# EAGLE schematic USB2DAC PCB (EAGLE 6.1)

## Sheet 1 of 4
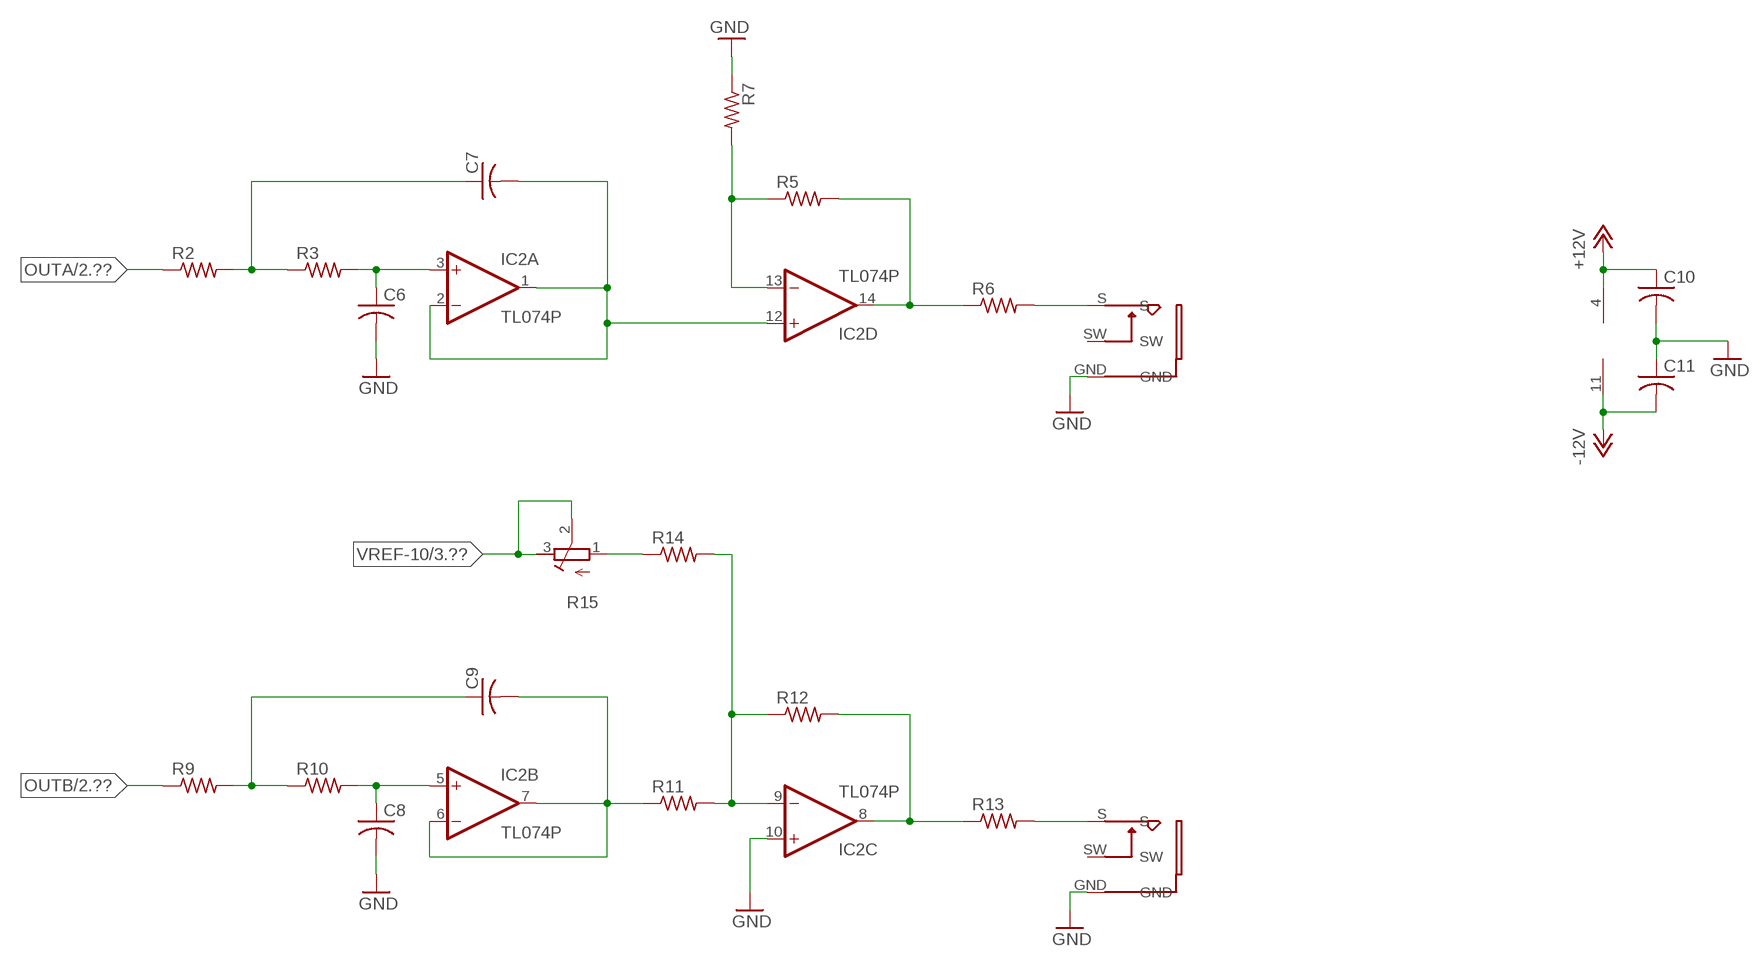
[diagram p0: schematic, sheet 1]

### Parts
C6  C-USC1206K  [C1206K]
C7  C-USC1206K  [C1206K]
C8  C-USC1206K  [C1206K]
C9  C-USC1206K  [C1206K]
C10  C-USC1206K  [C1206K]
C11  C-USC1206K  [C1206K]
IC2  TL074P  [DIL14]
OUT1  PJ302M  [PJ302M]
OUT2  PJ302M  [PJ302M]
R2  R-US_R1206  [R1206]
R3  R-US_R1206  [R1206]
R5  R-US_R1206  [R1206]
R6  R-US_R1206  [R1206]
R7  R-US_R1206  [R1206]
R9  R-US_R1206  [R1206]
R10  R-US_R1206  [R1206]
R11  R-US_R1206  [R1206]
R12  R-US_R1206  [R1206]
R13  R-US_R1206  [R1206]
R14  R-US_R1206  [R1206]
R15  R-TRIMM3296P  [RTRIM3296P]

### Nets
+12V: C10.1 IC2.4(P:V+) ; also sheet 2,3
-12V: C11.2 IC2.11(P:V-) ; also sheet 3
GND: C6.2 C8.2 C10.2 C11.1 IC2.10(C:+IN) OUT1.GND OUT2.GND R7.1 ; also sheet 2,3,4
N$10: C6.1 IC2.3(A:+IN) R3.2
N$11: C7.1 R2.2 R3.1
N$12: IC2.13(D:-IN) R5.1 R7.2
N$13: IC2.14(D:OUT) R5.2 R6.1
N$15: C9.2 IC2.6(B:-IN) IC2.7(B:OUT) R11.1
N$16: C8.1 IC2.5(B:+IN) R10.2
N$17: C9.1 R9.2 R10.1
N$18: IC2.9(C:-IN) R11.2 R12.1 R14.2
N$19: IC2.8(C:OUT) R12.2 R13.1
N$20: R14.1 R15.1(E)
N$31: C7.2 IC2.1(A:OUT) IC2.2(A:-IN) IC2.12(D:+IN)
OUT1: OUT1.S R6.2
OUT2: OUT2.S R13.2
OUTA: R2.1 ; also sheet 2
OUTB: R9.1 ; also sheet 2
VREF-10: R15.2(S) R15.3(A) ; also sheet 3
Unconnected: OUT1.SW OUT2.SW

## Sheet 2 of 4
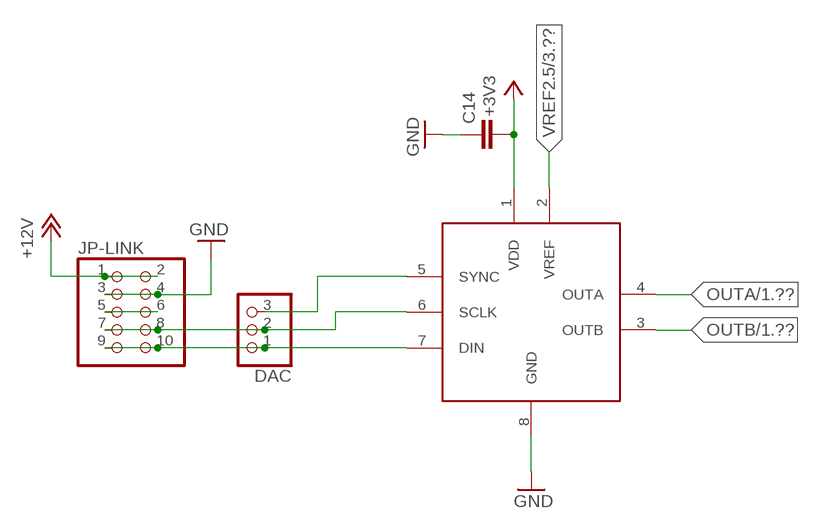
[diagram p1: schematic, sheet 2]

### Parts
C14  C-EUC1206K  [C1206K]
DAC  PINHD-1X3_2.54  [1X03]
JP-LINK  PINHD-2X5_2.54  [2X05]
U$1  DAC8552  [MSOP-8]

### Nets
+3V3: C14.2 U$1.1(VDD) ; also sheet 3
+12V: JP-LINK.1 JP-LINK.2 ; also sheet 1,3
GND: C14.1 JP-LINK.3 JP-LINK.4 U$1.8(GND) ; also sheet 1,3,4
N$1: DAC.3 U$1.5(SYNC)
N$2: DAC.2 JP-LINK.7 JP-LINK.8 U$1.6(SCLK)
N$3: DAC.1 JP-LINK.9 JP-LINK.10 U$1.7(DIN)
N$29: JP-LINK.5 JP-LINK.6
OUTA: U$1.4(OUTA) ; also sheet 1
OUTB: U$1.3(OUTB) ; also sheet 1
VREF2.5: U$1.2(VREF) ; also sheet 3

## Sheet 3 of 4
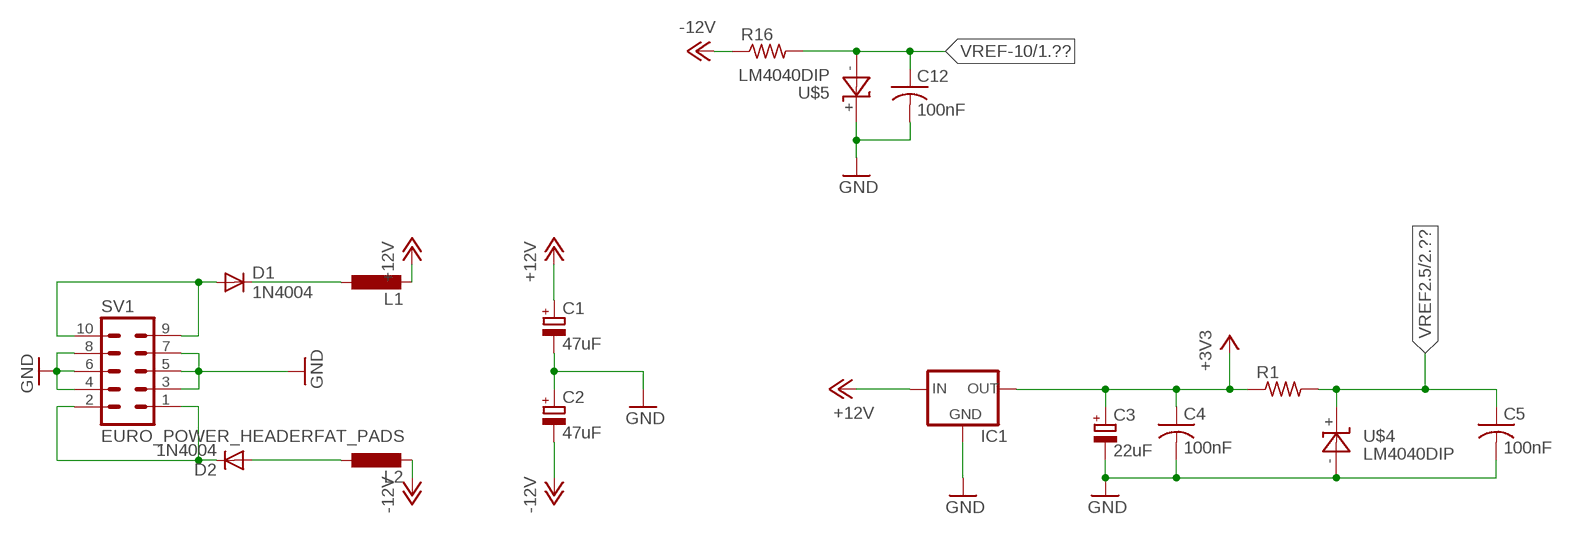
[diagram p2: schematic, sheet 3]

### Parts
C1  47uF  CPOL-EUE2-5  [E2-5]
C2  47uF  CPOL-EUE2-5  [E2-5]
C3  22uF  CPOL-EUE2-5  [E2-5]
C4  100nF  C-USC1206K  [C1206K]
C5  100nF  C-USC1206K  [C1206K]
C12  100nF  C-USC1206K  [C1206K]
D1  1N4004  [DO41-10]
D2  1N4004  [DO41-10]
IC1  78LXX  [78LXX]
L1  L-EU0207/10  [0207/10]
L2  L-EU0207/10  [0207/10]
R1  R-US_R1206  [R1206]
R16  R-US_R1206  [R1206]
SV1  EURO_POWER_HEADERFAT_PADS  [EURO_PWR_HEADER_FAT]
U$4  LM4040DIP  [TO-92]
U$5  LM4040DIP  [TO-92]

### Nets
+3V3: C3.+ C4.1 IC1.OUT R1.1 ; also sheet 2
+12V: C1.+ IC1.IN L1.2 ; also sheet 1,2
-12V: C2.- L2.2 R16.1 ; also sheet 1
GND: C1.- C2.+ C3.- C4.2 C5.2 C12.2 IC1.GND SV1.3 SV1.4 SV1.5 SV1.6 SV1.7 SV1.8 U$4.- U$5.+ ; also sheet 1,2,4
N$7: D2.C SV1.1 SV1.2
N$8: D1.A SV1.9 SV1.10
N$21: D2.A L2.1
N$22: D1.C L1.1
VREF2.5: C5.1 R1.2 U$4.+ ; also sheet 2
VREF-10: C12.1 R16.2 U$5.- ; also sheet 1

## Sheet 4 of 4
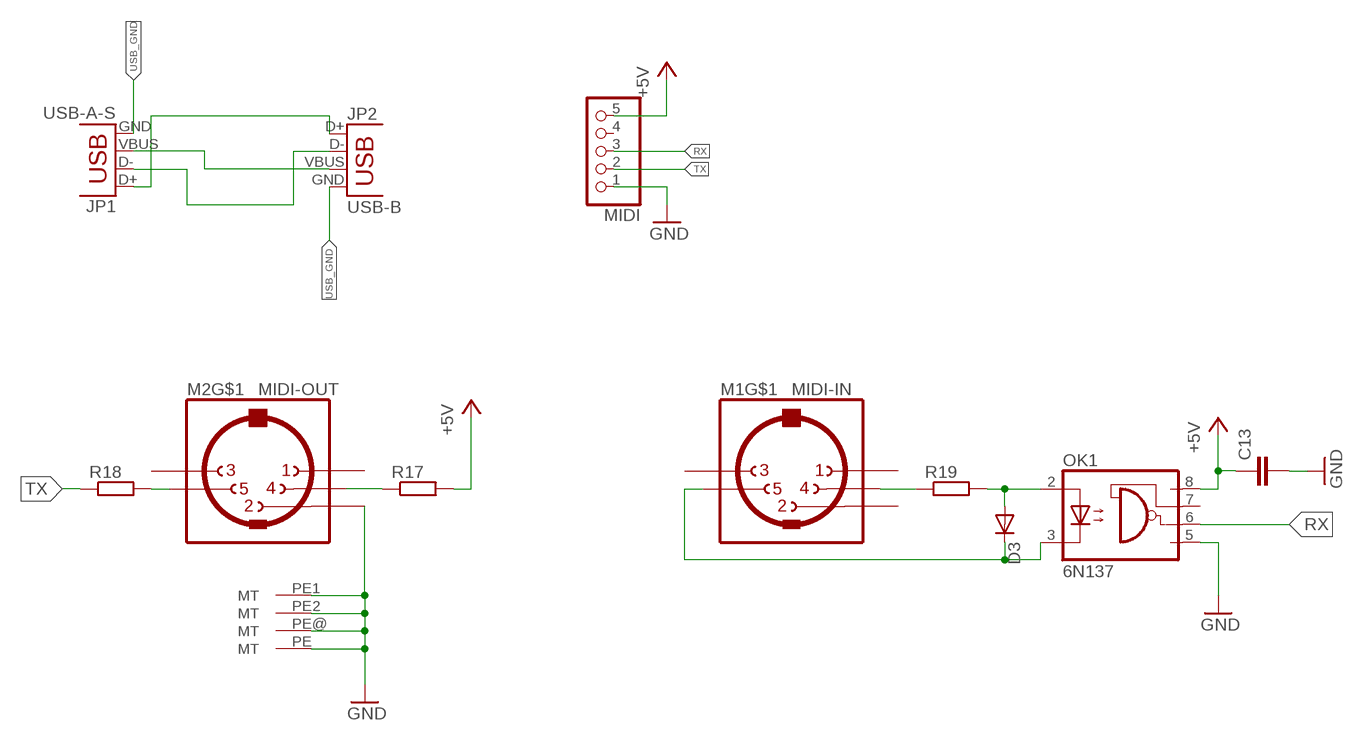
[diagram p3: schematic, sheet 4]

### Parts
C13  C-EUC1206K  [C1206K]
D3  SMALL_DIODEDO35-7  [DO35-7]
JP1  USB-A-S  [USB-A-S]
JP2  USB-B  USBPTH  [USB-B-PTH]
M1  MIDI-IN  MIDIJACK  [CP-2350]
M2  MIDI-OUT  MIDIJACK  [CP-2350]
MIDI  PINHD-1X5_2.54  [1X05]
OK1  6N137  [DIL08]
R17  R-EU_R1206  [R1206]
R18  R-EU_R1206  [R1206]
R19  R-EU_R1206  [R1206]

### Nets
+5V: C13.1 MIDI.5 OK1.8(VCC) R17.2
GND: C13.2 M2.2 M2.PE1(MT) M2.PE2(MT) M2.PE(MT) M2.PE@(MT) MIDI.1 OK1.5(GND) ; also sheet 1,2,3
N$5: D3.A OK1.2(A) R19.2
N$6: M2.5 R18.2
N$24: JP1.VBUS JP2.VBUS
N$25: JP1.D- JP2.D-
N$26: JP1.D+ JP2.D+
N$27: M2.4 R17.1
N$28: M1.4 R19.1
N$30: D3.C M1.5 OK1.3(C)
RX: MIDI.3 OK1.6(VO)
TX: MIDI.2 R18.1
USB_GND: JP1.GND JP2.GND
Unconnected: M1.1 M1.2 M1.3 M1.PE1(MT) M1.PE2(MT) M1.PE(MT) M1.PE@(MT) M2.1 M2.3 MIDI.4 OK1.7(VE)

## Library data of the parts
C1-C3 = resistor-mod:CPOL-EU: POLARIZED CAPACITOR, European symbol
C4-C12 = resistor-mod:C-US: CAPACITOR, American symbol
C13 C14 = resistor-mod:C-EU: CAPACITOR, European symbol
D1 D2 = diode:1N4004: DIODE general purpose rectifier, 1 A
D3 = MusicThingModular:SMALL_DIODE: Small Signal Diode
DAC = pinhead 2:PINHD-1X3: PIN HEADER
IC1 = v-reg:78LXX: VOLTAGE REGULATOR
IC2 = linear:TL074: OP AMP
JP1 = SparkFun-Connectors:USB: USB Connectors USB-B-PTH is fully proven SKU : PRT-00139/CONN-08278 USB-miniB is fully proven SKU : PRT-00587 USB-A-PCB is untested. USB-A-H is throughly reviewed, but untested. Spark Fun Electronics SKU : PRT-00437 USB-B-SMT is throughly reviewed, but untested. Needs silkscreen touching up. USB-A-S has not been used/tested USB-MB-H has not been used/tested USB-MICROB has been used. CONN-09505
JP2 = SparkFun-Connectors:USB: USB Connectors USB-B-PTH is fully proven SKU : PRT-00139/CONN-08278 USB-miniB is fully proven SKU : PRT-00587 USB-A-PCB is untested. USB-A-H is throughly reviewed, but untested. Spark Fun Electronics SKU : PRT-00437 USB-B-SMT is throughly reviewed, but untested. Needs silkscreen touching up. USB-A-S has not been used/tested USB-MB-H has not been used/tested USB-MICROB has been used. CONN-09505; PROD_ID: CONN-08278
JP-LINK = pinhead 2:PINHD-2X5: PIN HEADER
L1 L2 = resistor-mod:L-EU: INDUCTOR, European symbol
M1 M2 = adafruit:MIDIJACK: DIN 5 jack also known as MIDI jack A modification of conn-hirshman:MAB5SH with two options for the grounding 'teeth'
MIDI = pinhead 2:PINHD-1X5: PIN HEADER
OK1 = optocoupler:6N137: MOTOROLA OPTO COUPLER; MPN: 6N137; OC_FARNELL: 1328376; OC_NEWARK: 52M1895
OUT1 OUT2 = PJ203M 3.5mm:PJ302M: Klinkenbuchse 3.5mm Thonk
R1-R3 R5-R7 R9-R14 R16 = resistor-mod:R-US_: RESISTOR, American symbol
R15 = resistor-mod:R-TRIMM: Trimm resistor
R17-R19 = resistor-mod:R-EU_: RESISTOR, European symbol
SV1 = MusicThingModular mod:EURO_POWER_HEADER: Power Header 10 pin power header for Eurorack Power Supplies Variants with fatter pads for easier soldering, and the LOCK variant which has 5mil offset pins to hold the component in place before soldering
U$1 = og-dac:DAC8552
U$4 U$5 = GuShH:LM4040